# Altium project Sonic Sandbox.PrjPcb
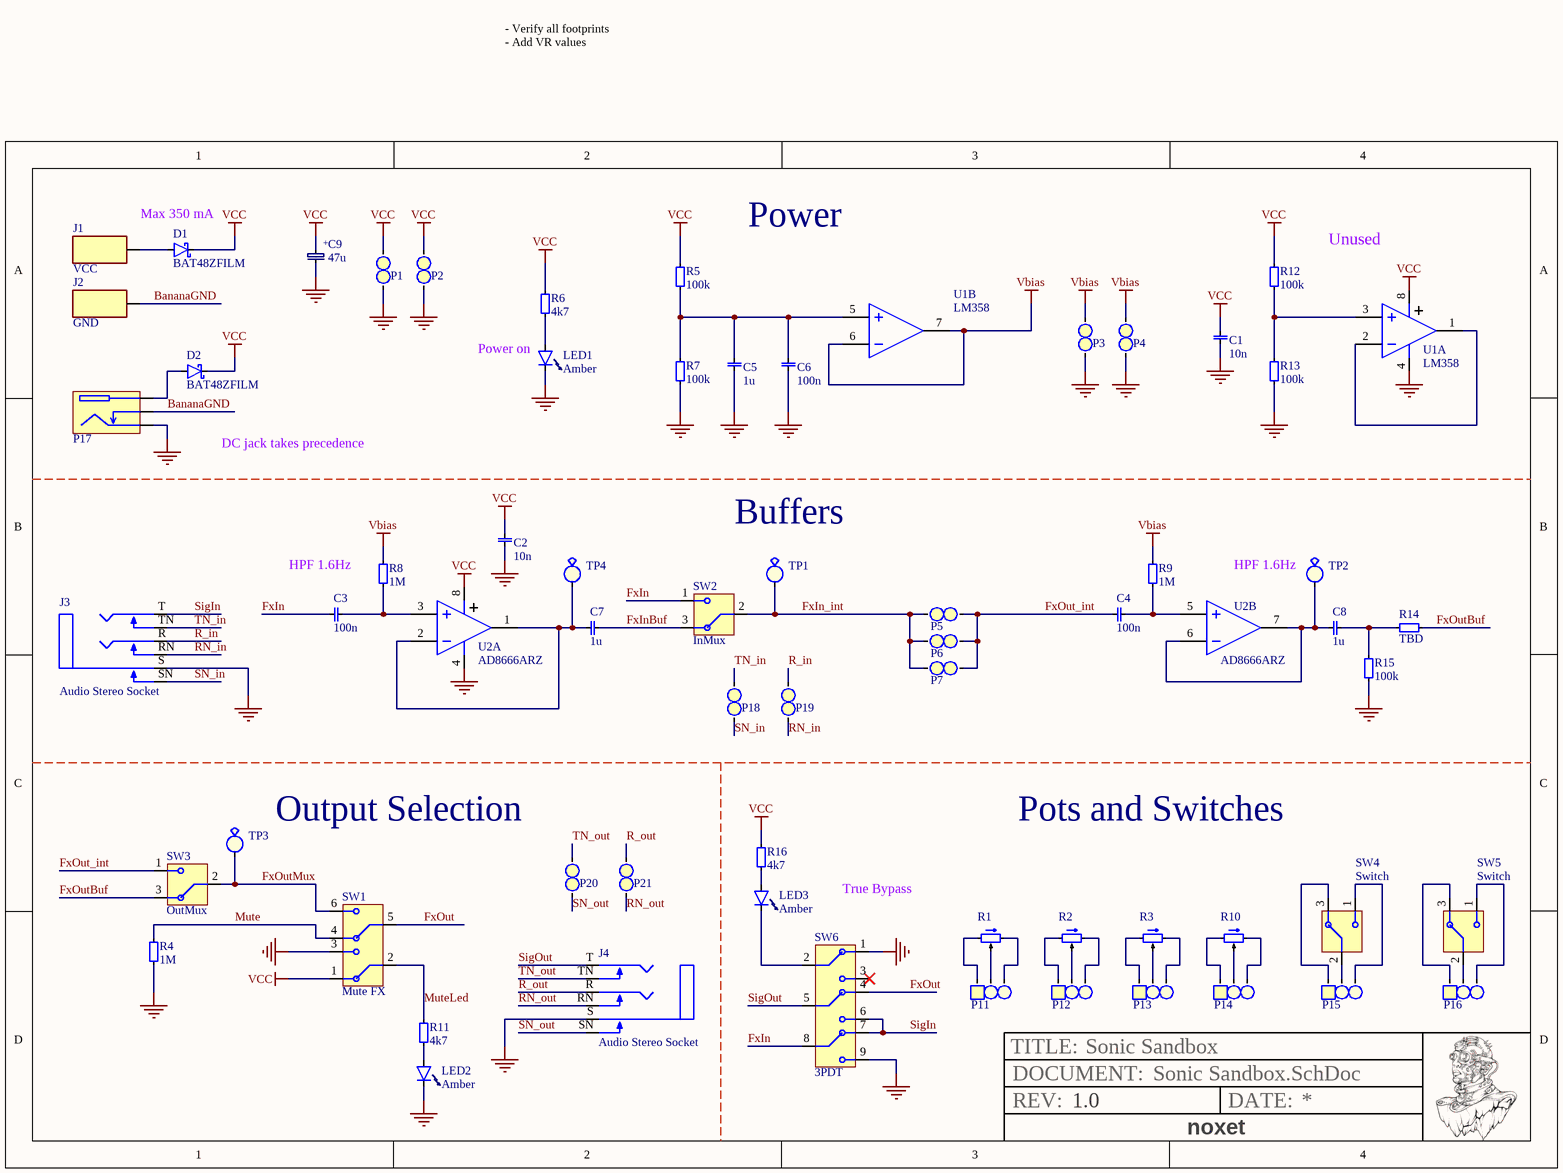
[diagram p0: Sonic Sandbox.SchDoc]
Revision: 1.0; Title: Sonic Sandbox
1 sheet, 64 parts. Net scope: global (net labels, ports and power ports of the same name join across sheets).
Board file: Sonic Sandbox.PcbDoc

## Sheet Sonic Sandbox.SchDoc: Sonic Sandbox
size A4; SheetNumber: 1; SheetTotal: 1

### Parts
C1  value 10n  [0805, cap]  (hidden comment: 0805, capacitor)
C2  value 10n  [0805, cap]  (hidden comment: 0805, capacitor)
C3  value 100n  [0805, cap]  (hidden comment: 0805, capacitor)
C4  value 100n  [0805, cap]  (hidden comment: 0805, capacitor)
C5  value 1u  [0805, cap]  (hidden comment: 0805, capacitor)
C6  value 100n  [0805, cap]  (hidden comment: 0805, capacitor)
C7  value 1u  [0805, cap]  (hidden comment: 0805, capacitor)
C8  value 1u  [0805, cap]  (hidden comment: 0805, capacitor)
C9  value 47u  [Cap, SMD, Polar, 5.3x5.3mm]  (hidden comment: Capacitor, TH 2mm)
D1  BAT48ZFILM  [SOD123]
D2  BAT48ZFILM  [SOD123]
J1  VCC  [Banana Conn VCC]
J2  GND  [Banana Conn GND]
J3  Audio Stereo Socket  [6.3mm Audio Socket PCB]
J4  Audio Stereo Socket  [6.3mm Audio Socket PCB]
LED1  Amber  [0805_led]
LED2  Amber  [0805_led]
LED3  Amber  [0805_led]
P1  1x2 Pin Heade Straight  [padtwo_L]  (value not drawn)
P2  1x2 Pin Heade Straight  [padtwo_L]  (value not drawn)
P3  1x2 Pin Heade Straight  [padtwo_L]  (value not drawn)
P4  1x2 Pin Heade Straight  [padtwo_L]  (value not drawn)
P5  1x2 Pin Heade Straight  [padtwo_L]  (value not drawn)
P6  1x2 Pin Heade Straight  [padtwo_L]  (value not drawn)
P7  1x2 Pin Heade Straight  [padtwo_L]  (value not drawn)
P11  1x3 Pin Header  [padThree_L]  (value not drawn)
P12  1x3 Pin Header  [padThree_L]  (value not drawn)
P13  1x3 Pin Header  [padThree_L]  (value not drawn)
P14  1x3 Pin Header  [padThree_L]  (value not drawn)
P15  1x3 Pin Header  [padThree_L]  (value not drawn)
P16  1x3 Pin Header  [padThree_L]  (value not drawn)
P17  Power socket  [DC Plug PCB]  (value not drawn)
P18  1x2 Pin Heade Straight  [padtwo_L]  (value not drawn)
P19  1x2 Pin Heade Straight  [padtwo_L]  (value not drawn)
P20  1x2 Pin Heade Straight  [padtwo_L]  (value not drawn)
P21  1x2 Pin Heade Straight  [padtwo_L]  (value not drawn)
R1  Potentiometer  [RK09L_15mm]  (value not drawn)
R2  Potentiometer  [RK09L_15mm]  (value not drawn)
R3  Potentiometer  [RK09L_15mm]  (value not drawn)
R4  value 1M  [0805]  (hidden comment: General resistor)
R5  value 100k  [0805]  (hidden comment: General resistor)
R6  value 4k7  [0805]  (hidden comment: General resistor)
R7  value 100k  [0805]  (hidden comment: General resistor)
R8  value 1M  [0805]  (hidden comment: General resistor)
R9  value 1M  [0805]  (hidden comment: General resistor)
R10  Potentiometer  [RK09L_15mm]  (value not drawn)
R11  value 4k7  [0805]  (hidden comment: General resistor)
R12  value 100k  [0805]  (hidden comment: General resistor)
R13  value 100k  [0805]  (hidden comment: General resistor)
R14  value TBD  [0805]  (hidden comment: General resistor)
R15  value 100k  [0805]  (hidden comment: General resistor)
R16  value 4k7  [0805]  (hidden comment: General resistor)
SW1  Mute FX  [SW_DPDT_MTS-202-A2]
SW2  InMux  [SW_SPDT_SMTS-102-A2]
SW3  OutMux  [SW_SPDT_SMTS-102-A2]
SW4  Switch  [SW_SPDT_SMTS-102-A2]
SW5  Switch  [SW_SPDT_SMTS-102-A2]
SW6  3PDT  [SW_3PDT_PBS-24-302]
TP1  Test Point  [TESTPOINT_SMD]  (value not drawn)
TP2  Test Point  [TESTPOINT_SMD]  (value not drawn)
TP3  Test Point  [TESTPOINT_SMD]  (value not drawn)
TP4  Test Point  [TESTPOINT_SMD]  (value not drawn)
U1  LM358  [SOIC8]  (parts A,B of 2)
U2  AD8666ARZ  [SOIC8]  (parts A,B of 2)

### Nets
GND: C1.2 C2.2 C5.2 C6.2 C9.1 J3.S J4.S LED1.0(Cathode) LED2.0(Cathode) P1.2 P2.2 P3.2 P4.2 P17.2 R4.1 R7.1 R13.1 R15.2 SW1.3 SW6.1 SW6.9 U1.4(V-) U2.4(V-)
Vbias: P3.1 P4.1 R8.2 R9.2 U1.6(IN-) U1.7(OUT)
VCC: C1.1 C2.1 C9.2 D1.1(K) D2.1(K) P1.1 P2.1 R5.2 R6.2 R12.2 R16.2 SW1.1 U1.8(V+) U2.8(V+)
BananaGND: J2.1 P17.3
FxIn: C3.2 SW2.1 SW6.8
FxIn_int: P5.2 P6.2 P7.2 SW2.2 TP1.0
FxInBuf: C7.1 SW2.3
FxOut: SW1.5 SW6.4
FxOut_int: C4.2 P5.1 P6.1 P7.1 SW3.1
FxOutBuf: R14.1 SW3.3
FxOutMux: SW1.6 SW3.2 TP3.0
Mute: R4.2 SW1.4
MuteLed: R11.2 SW1.2
R_in: J3.R P19.1
R_out: J4.R P21.1
RN_in: J3.RN(~{R}) P19.2
RN_out: J4.RN(~{R}) P21.2
SigIn: J3.T SW6.6 SW6.7
SigOut: J4.T SW6.5
SN_in: J3.SN(~{S}) P18.2
SN_out: J4.SN(~{S}) P20.2
TN_in: J3.TN(~{T}) P18.1
TN_out: J4.TN(~{T}) P20.1
NetC3_1: C3.1 R8.1 U2.3(IN+)
NetC4_1: C4.1 R9.1 U2.5(IN+)
NetC5_1: C5.1 C6.1 R5.1 R7.2 U1.5(IN+)
NetC7_2: C7.2 TP4.0 U2.1(OUT) U2.2(IN-)
NetC8_1: C8.1 R14.2 R15.1
NetC8_2: C8.2 TP2.0 U2.6(IN-) U2.7(OUT)
NetD1_2: D1.2(A) J1.1
NetD2_2: D2.2(A) P17.1
NetLED1_1: LED1.1 R6.1
NetLED2_1: LED2.1 R11.1
NetLED3_0: LED3.0(Cathode) SW6.2
NetLED3_1: LED3.1 R16.1
NetP11_1: P11.1 R1.1
NetP11_2: P11.2 R1.2
NetP11_3: P11.3 R1.3
NetP12_1: P12.1 R2.1
NetP12_2: P12.2 R2.2
NetP12_3: P12.3 R2.3
NetP13_1: P13.1 R3.1
NetP13_2: P13.2 R3.2
NetP13_3: P13.3 R3.3
NetP14_1: P14.1 R10.1
NetP14_2: P14.2 R10.2
NetP14_3: P14.3 R10.3
NetP15_1: P15.1 SW4.3
NetP15_2: P15.2 SW4.2
NetP15_3: P15.3 SW4.1
NetP16_1: P16.1 SW5.3
NetP16_2: P16.2 SW5.2
NetP16_3: P16.3 SW5.1
NetR12_1: R12.1 R13.2 U1.3(IN+)
NetU1_1: U1.1(OUT) U1.2(IN-)

Not connected (* = marked no-connect by the designer): SW6 3*

### Notes on the sheet
- - Verify all footprints
  - Add VR values
- Max 350 mA
- Power
- Unused
- (near LED1) Power on
- DC jack takes precedence
- HPF 1.6Hz
- Buffers
- (near TP2) HPF 1.6Hz
- Output Selection
- Pots and Switches
- True Bypass
- TITLE:
- REV:
- DOCUMENT:
- noxet
- DATE:
- (in symbol Capacitor, TH 2mm) +

### Library data of the parts
C9 = Capacitor, TH 2mm: Capacitor TH 2mm; Supplier: *; Order number: *
D1 D2 = BAT48ZFILM: Rectifier Diode, Schottky, 1 Phase, 1 Element, 0.35A, 40V V(RRM), Silicon; Manufacturer: STMicroelectronics; Package Body Material: Plastic; Forward Voltage: 250mV; Non-rep Pk Forward Current-Max: 2A; Number of Elements: 1; Max Output current: 350mA; Time @ Peak Reflow Temperature-Max (s): 30s; Qualification Status: Not Qualified; Supplier: Rs; Supplier Part Number: 7146853P; Manufacturer Part Number: BAT48ZFILM; RoHS: Yes; Category: Rectifier Diodes; Stock: 13200; Pricing: 250=2,567, 500=2,311, 1250=2,081, 2500=1,976 (SEK); Pins: 2; Diode Element Material: SILICON; Package Shape: Rectangular; Terminal Finish: Tin; Max Operating Temperature: 150°C; JESD-609 Code: e3; Diode Type: RECTIFIER; JESD-30 Code: R-PDSO-G2; Package Style: SMALL OUTLINEMeter; Peak Reflow Temperature (Cel): 260°C; Rep Pk Reverse Voltage-Max: 40V; Surface Mount: Yes; Technology: SCHOTTKY; Terminal Form: Gull Wing; Terminal Position: DUAL; Reach SVHC Compliant: No; RoHS Compliant: Yes; ComponentLink1URL: https://datasheet.ciiva.com:443/pdfs/VipMasterIC/IC/SGST/SGSTS30425/SGSTS30425-1.pdf?src-supplier=IHS+Markit; ComponentLink1Description: https://datasheet.ciiva.com:443/pdfs/VipMasterIC/IC/SGST/SGSTS30425/SGSTS30425-1.pdf?src-supplier=IHS+Markit; ComponentLink2URL: https://datasheet.ciiva.com/16421/cd00130229-16421639.pdf?src-supplier=Future+Electronics; ComponentLink2Description: https://datasheet.ciiva.com/16421/cd00130229-16421639.pdf?src-supplier=Future+Electronics; ComponentLink3URL: https://datasheet.ciiva.com/915/cd00130229-915584.pdf?src-supplier=Digikey; ComponentLink3Description: https://datasheet.ciiva.com/915/cd00130229-915584.pdf?src-supplier=Digikey; ComponentLink4URL: https://datasheet.ciiva.com/915/cd00130229-915585.pdf?src-supplier=Digikey; ComponentLink4Description: https://datasheet.ciiva.com/915/cd00130229-915585.pdf?src-supplier=Digikey; ComponentLink5URL: https://datasheet.ciiva.com/915/cd00130229-915586.pdf?src-supplier=Digikey; ComponentLink5Description: https://datasheet.ciiva.com/915/cd00130229-915586.pdf?src-supplier=Digikey; ComponentLink6URL: https://datasheet.ciiva.com/4714/cd00130229-4714093.pdf?src-supplier=Mouser; ComponentLink6Description: https://datasheet.ciiva.com/4714/cd00130229-4714093.pdf?src-supplier=Mouser
J1 J2 = Banana conn: Banana Connector 571-0100; Manufacturer_Name: Deltron; Datasheet Link: https://www.dem-uk.com/deltron-components/Data/Product_Downloads/deltron-571-0100-4mm-90deg-single-socket-data.pdf; Height: 12.4mm; Manufacturer_Part_Number: 571-0100; Mouser Part Number: 164-6218; Mouser Price/Stock: https://www.mouser.com/Search/Refine.aspx?Keyword=164-6218
J3 J4 = 6.3mm Audio Socket
LED1-LED3 = 0805, LED: Value: 0805 LED
P1-P7 P18-P21 = 1x2 Pin Heade Straight: 2.54 mm, TH; Value: 1x2 Pin Header
P11-P16 = 1x3 Pin Header: 2.54 mm; Value: 1x3 Pin Header
R1-R3 R10 = Potentiometer: Value: 0; ELFA: 300-08-353
R4-R9 R11-R16 = resistor
SW1 = Switch DPDT: Toggle switch DPDT
SW2-SW5 = Switch SPDT: Toggle switch SPDT
SW6 = Switch 3PDT: Toggle switch 3PDT
U1 = LM358DR: IC OPAMP GP 700KHZ 8SOIC; Manufacturer: Texas Instruments; Number of Circuits: 2; Nominal Supply Current: 1.2mA; Max Supply Voltage: 32V; Min Supply Voltage: 3V; Operating Supply Voltage: 16V; Slew Rate: 0.3V/µs; Common Mode Rejection Ratio: 65dB; Min Dual Supply Voltage: 1.5V; Output Current: 30mA; Voltage Gain: 100dB; Input Bias Current: 250nA; Input Offset Voltage (Vos): 7mV; Operating Supply Current: 1mA; Amplifier Type: GENERAL PURPOSE; Dual Supply Voltage: 9V; Supplier 1: Mouser; Manufacturer Part Number: LM358DR; RoHS: Yes; Category: Amplifiers - Op Amps, Buffer, Instrumentation; Stock 1: 281120; Pricing 1: 1=0,37000, 10=0,29900, 50=0,29900, 100=0,18500, 1000=0,11500, 10000=0,10400 (USD); Mounting Technology: Surface Mount; Case/Package: SOIC; Pins: 8; Contact Plating: Gold; Min Operating Temperature: 0°C; Max Operating Temperature: 70°C; Packaging: Tape and Reel; Number of Channels: 2; Bandwidth: 700kHz; Gain Bandwidth Product: 700kHz; Package Quantity: 2500; Supply Current: 1.2mA; Max Dual Supply Voltage: 16V; Output Current per Channel: 30mA; Series: -; Technology: BIPOLAR; Number of Elements: 2; Number of Amplifiers: 2; Unity Gain Bandwidth Product: 700kHz; Power Supply Rejection Ratio (PSRR): 65dB; Length: 4.9mm; Width: 3.91mm; Height: 1.58mm; Radiation Hardening: No; Lead Free: Lead Free; RoHS Compliant: Yes; Reach SVHC Compliant: Yes; ComponentLink1URL: https://datasheet.ciiva.com/1795/lm358-1795488.pdf?src-supplier=Digi-Key; ComponentLink1Description: https://datasheet.ciiva.com/1795/lm358-1795488.pdf?src-supplier=Digi-Key; ComponentLink2URL: https://datasheet.ciiva.com/27056/2016330-27056228.pdf?src-supplier=Jameco; ComponentLink2Description: https://datasheet.ciiva.com/27056/2016330-27056228.pdf?src-supplier=Jameco; ComponentLink3URL: https://datasheet.ciiva.com/7709/1874566-7709823.pdf?src-supplier=Element14; ComponentLink3Description: https://datasheet.ciiva.com/7709/1874566-7709823.pdf?src-supplier=Element14; ComponentLink4URL: https://datasheet.ciiva.com/46385/1874566-46385851.pdf?src-supplier=Element14; ComponentLink4Description: https://datasheet.ciiva.com/46385/1874566-46385851.pdf?src-supplier=Element14; ComponentLink5URL: https://datasheet.ciiva.com/46390/1874566-46390414.pdf?src-supplier=Element14; ComponentLink5Description: https://datasheet.ciiva.com/46390/1874566-46390414.pdf?src-supplier=Element14; ComponentLink6URL: https://datasheet.ciiva.com/1795/lm358-1795487.pdf?src-supplier=Digi-Key; ComponentLink6Description: https://datasheet.ciiva.com/1795/lm358-1795487.pdf?src-supplier=Digi-Key; ComponentLink7URL: https://datasheet.ciiva.com/1795/lm358-1795489.pdf?src-supplier=Digi-Key; ComponentLink7Description: https://datasheet.ciiva.com/1795/lm358-1795489.pdf?src-supplier=Digi-Key; ComponentLink8URL: https://datasheet.ciiva.com/2973/lm358a-2973386.pdf?src-supplier=Avnet; ComponentLink8Description: https://datasheet.ciiva.com/2973/lm358a-2973386.pdf?src-supplier=Avnet; Supplier Part Number 1: 595-LM358DR
U2 = AD8666ARZ: Operational Amplifier, 2 Func, 5000uV Offset-Max, CMOS, PDSO8; Manufacturer: Analog Devices; Package Body Material: Plastic; Architecture: VOLTAGE-FEEDBACK; Average Bias Current-Max (IIB): 550pA; Bias Current-Max (IIB) @25C: 1pA; Common-mode Reject Ratio-Nom: 100dB; Frequency Compensation: YES; Input Offset Voltage-Max: 5mV; Low-Offset: No; Neg Supply Voltage Limit-Max: 0V; Channels: 2; Package Equivalence Code: SOP8,.25; Power Supplies: +-2.5/+-8/5/16V; Slew Rate: 3.5V/µs; Max Supply Current: 4mA; Supply Voltage Limit-Max: 18V; Nominal Supply Voltage: 5V; Time @ Peak Reflow Temperature-Max (s): 30s; Unity Gain BW-Nom: 4MHz; Voltage Gain-Min: 68000; Qualification Status: Not Qualified; Supplier: Mouser; Supplier Part Number: 584-AD8666ARZ; Manufacturer Part Number: AD8666ARZ; RoHS: Yes; Category: Amplifiers - Op Amps, Buffer, Instrumentation; Stock: 1754; Pricing: 1=2,83, 10=1,96, 50=1,96, 100=1,63, 1000=1,63, 10000=1,63 (USD); Case/Package: SOP; Pins: 8; Package Shape: Rectangular; Terminal Finish: Tin; Min Operating Temperature: -40°C; Max Operating Temperature: 125°C; JESD-609 Code: e3; Amplifier Type: OPERATIONAL AMPLIFIER; JESD-30 Code: R-PDSO-G8; Low-Bias: Yes; Micropower: No; Moisture Sensitivity Level: 1; Neg Supply Voltage-Nom (Vsup): 0V; Package Style: SMALL OUTLINEMeter; Peak Reflow Temperature (Cel): 260°C; Power: No; Programmable Power: No; Surface Mount: Yes; Technology: CMOS; Terminal Form: Gull Wing; Terminal Position: DUAL; Wideband: No; Length: 4.9mm; Width: 3.9mm; Height - Seated (Max): 1.75mm; Terminal Pitch: 1.27mm; Temperature Grade: AUTOMOTIVE; Reach SVHC Compliant: Yes; RoHS Compliant: Yes; ComponentLink1URL: https://datasheet.ciiva.com:443/pdfs/VipMasterIC/IC/ANDI/ANDIS11402/ANDIS11402-1.pdf?src-supplier=IHS+Markit; ComponentLink1Description: https://datasheet.ciiva.com:443/pdfs/VipMasterIC/IC/ANDI/ANDIS11402/ANDIS11402-1.pdf?src-supplier=IHS+Markit; ComponentLink2URL: https://datasheet.ciiva.com/1487/1481546-1487312.pdf?src-supplier=Element14; ComponentLink2Description: https://datasheet.ciiva.com/1487/1481546-1487312.pdf?src-supplier=Element14; ComponentLink3URL: https://datasheet.ciiva.com/2974/ad8665-ad8666-ad8668-2974734.pdf?src-supplier=Avnet; ComponentLink3Description: https://datasheet.ciiva.com/2974/ad8665-ad8666-ad8668-2974734.pdf?src-supplier=Avnet; ComponentLink4URL: https://datasheet.ciiva.com/1794/ad8665-ad8666-ad8668-1794389.pdf?src-supplier=Digikey; ComponentLink4Description: https://datasheet.ciiva.com/1794/ad8665-ad8666-ad8668-1794389.pdf?src-supplier=Digikey; ComponentLink5URL: https://datasheet.ciiva.com/48705/001249492-da-01-en-ic-opamp-gp-r-r-4mh-ad8666arz-soic-8-adi-48705820.pdf?src-supplier=Conrad; ComponentLink5Description: https://datasheet.ciiva.com/48705/001249492-da-01-en-ic-opamp-gp-r-r-4mh-ad8666arz-soic-8-adi-48705820.pdf?src-supplier=Conrad
TP1-TP4 = Test Point: Value: Test point; Farnell: 1702006